# EasyEDA Pro project ProPrj_esp32s3-ai-chat_audio_2024-09-03.epro

# Schematic Schematic1
Board Name: Board1; Create Date: 2024-08-29
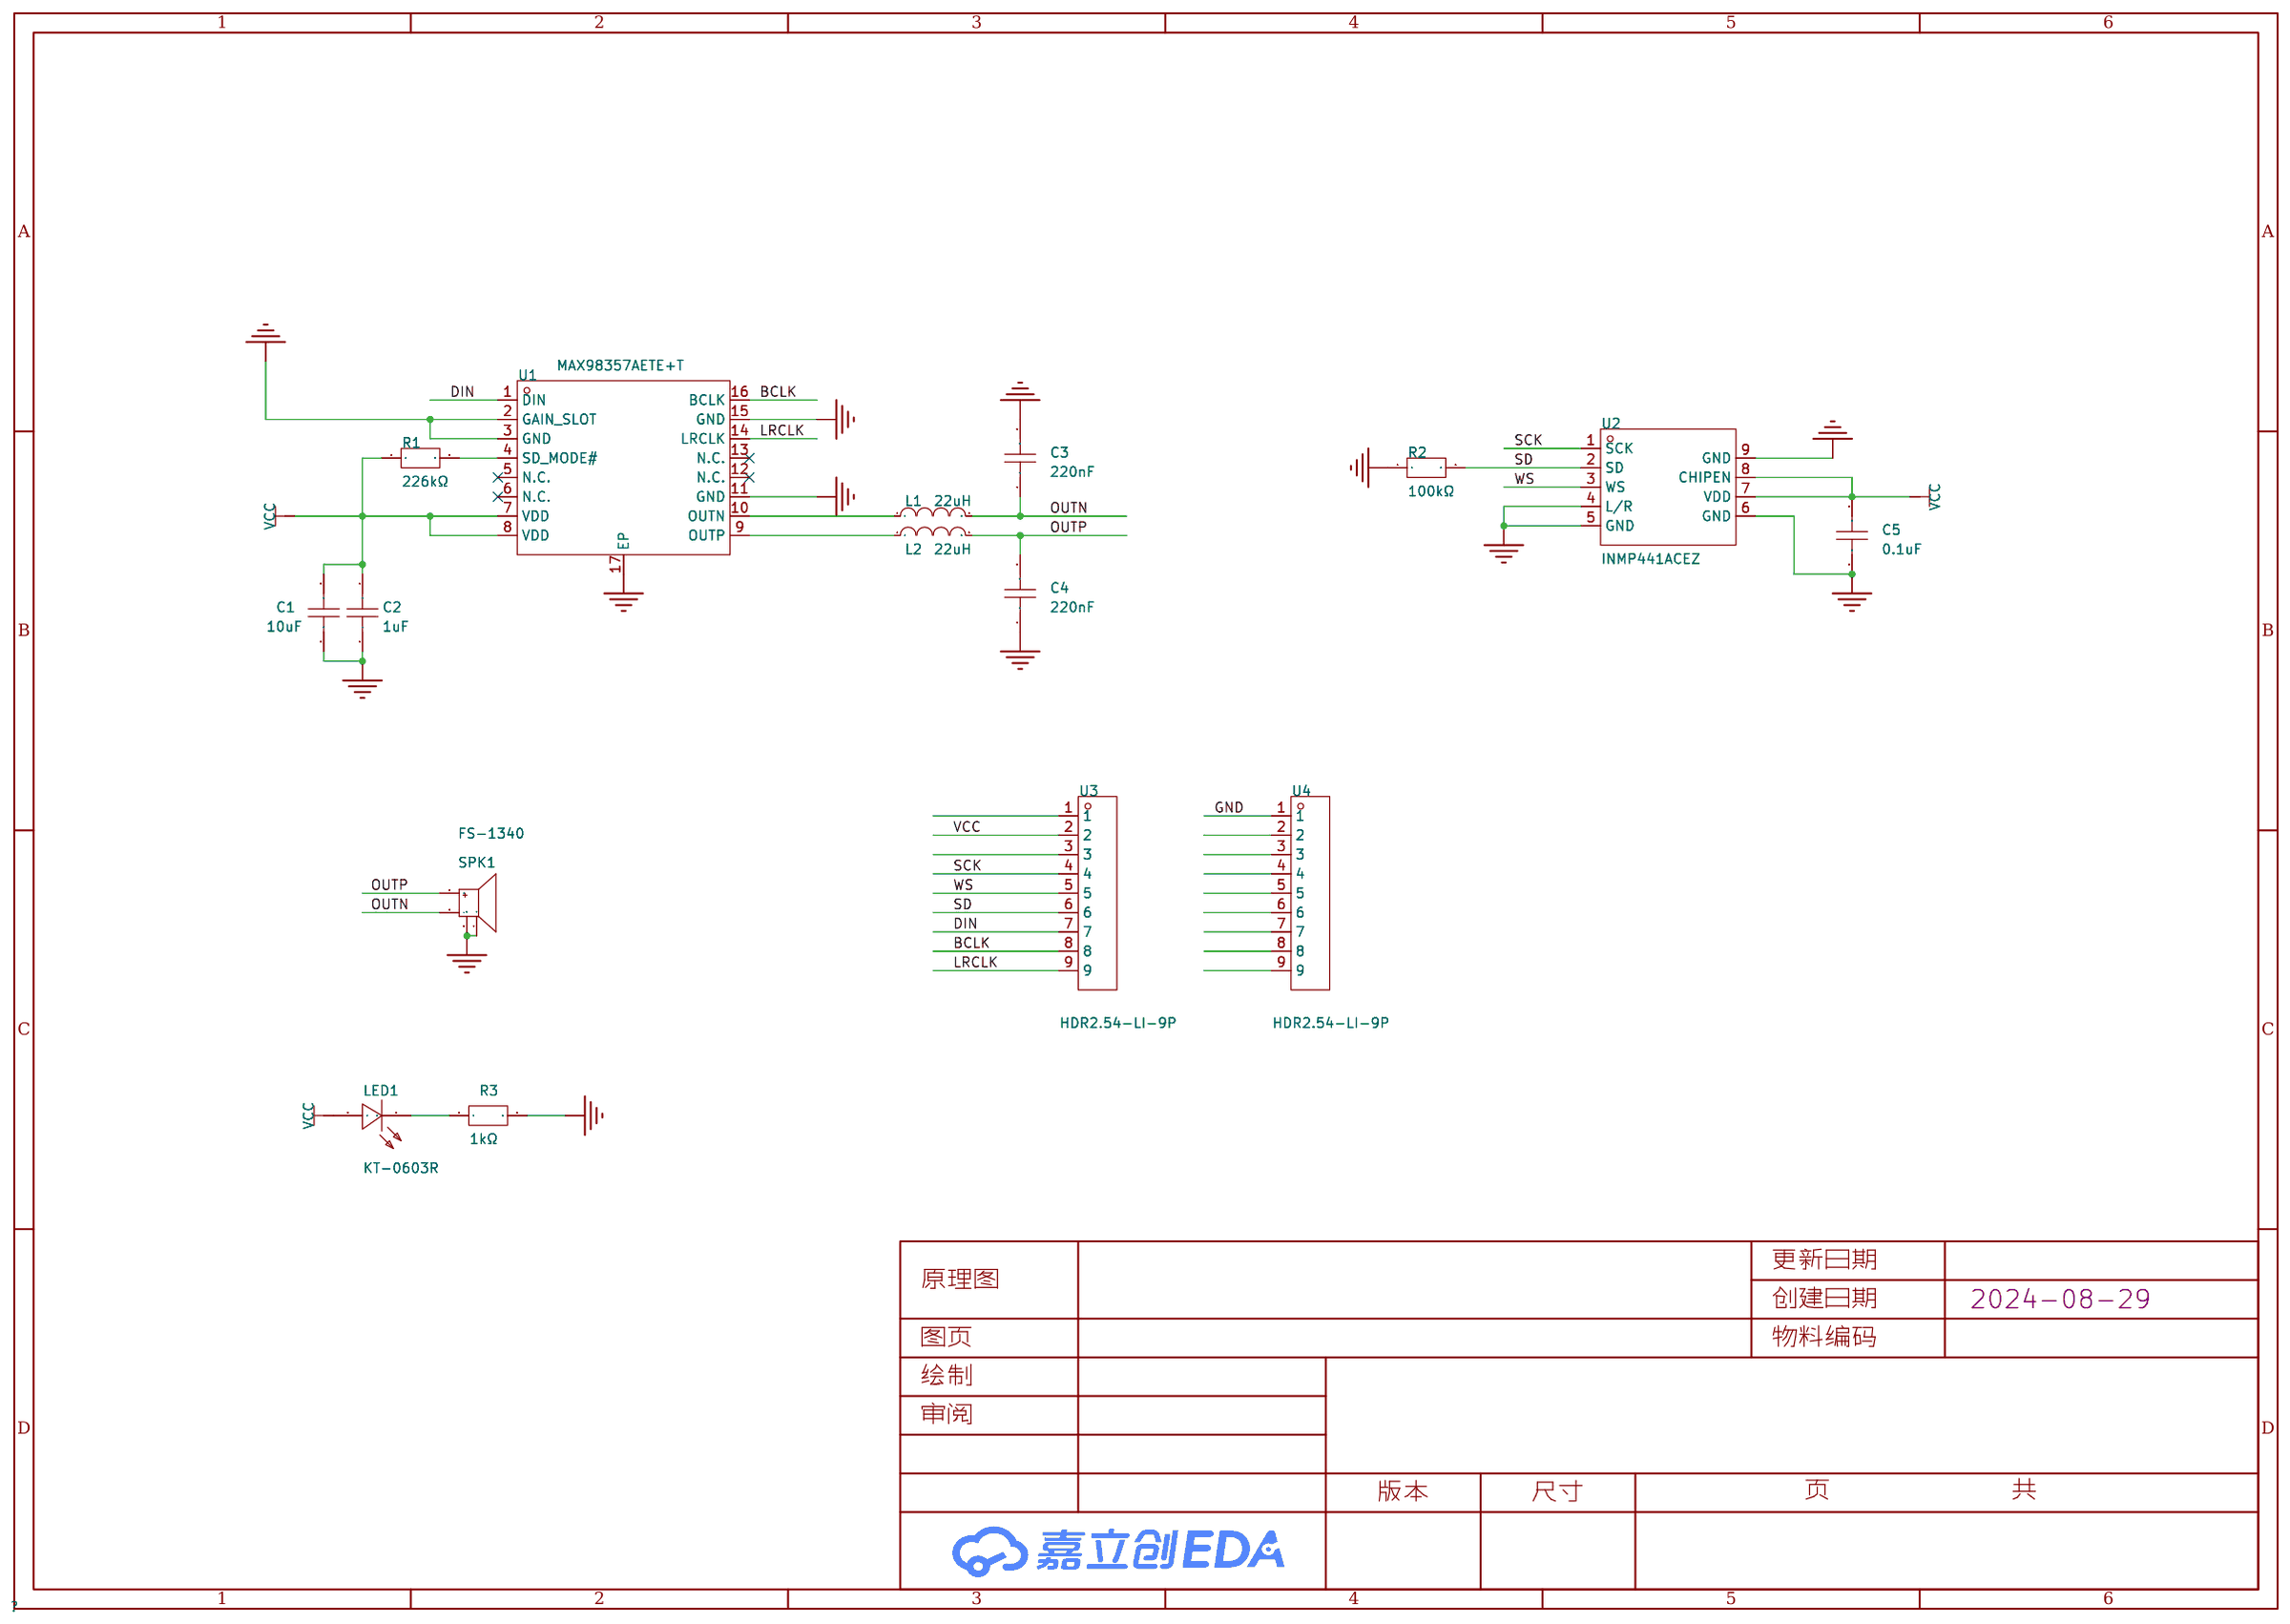
[diagram p0: schematic sheet]

## Parts
C1  10uF  [C0603]
C2  1uF  [C0603]
C3  220nF  [C0603]
C4  220nF  [C0603]
C5  0.1uF  [C0603]
L1  22uH  [L0603]
L2  22uH  [L0603]
LED1  KT-0603R  [LED0603-RD]
R1  226kΩ  [R0603]
R2  100kΩ  [R0603]
R3  1kΩ  [R0603]
SPK1  FS-1340  [BUZ-SMD_4P-L13.0-W13.0-P11.4-BL]
U1  MAX98357AETE+T  [TQFN-16_L3.0-W3.0-P0.50-BL-EP1.5]
U2  INMP441ACEZ  [MID-SMD_L4.7-W3.8_INMP441ACEZ]
U3  HDR2.54-LI-9P  [HDR-TH_9P-P2.54-V-M]
U4  HDR2.54-LI-9P  [HDR-TH_9P-P2.54-V-M]

## Library data of the parts
C1-C5 = GRT188C81A106ME13J: 容值:10uF;精度:±20%;额定电压:10V;材质(温度系数):X6S;; LCSC Part Name: 10uF ±20% 10V; Supplier Part: C3859070; Manufacturer: muRata(村田); Supplier Footprint: 0603; JLCPCB Part Class: 扩展库; Datasheet: https://atta.szlcsc.com/upload/public/pdf/source/20210818/CBE219D8DE527EBAD6F9BA52C7DC1A42.pdf; Supplier: LCSC; Tolerance: ±20%; Voltage Rated: 10V; Temperature Coefficient: X6S
L1 L2 = MLF1608C220M: 电感值:22uH;精度:±20%;额定电流:2mA;饱和电流(Isat):-;直流电阻(DCR):1.7Ω;; LCSC Part Name: 22uH ±20%; Supplier Part: C3910439; Manufacturer: TDK; Supplier Footprint: 0603; JLCPCB Part Class: 扩展库; Datasheet: https://atta.szlcsc.com/upload/public/pdf/source/20200601/C574026_39E6D4F4CCB543012DB5E9A7AB7C2E6F.pdf; Supplier: LCSC; Tolerance: ±20%; Rated Current: 2mA; DC Resistance (DCR): 1.7Ω; Q @ Freq: 20@1MHz; Frequency - Self Resonant: 18MHz
LED1 = KT-0603R: 发光颜色:红色;功率:-;正向电流:-;主波长:-;二极管配置:-;透镜颜色:-;色温:-;发光角度:-;载带方式:-;工作温度:-40℃~+85℃;; LCSC Part Name: 0603 红灯 高亮; Supplier Part: C2286; Manufacturer: KENTO; Supplier Footprint: 0603; JLCPCB Part Class: 基础库; Datasheet: https://atta.szlcsc.com/upload/public/pdf/source/20160616/1466072038404.pdf; Supplier: LCSC; Emitted Color: 红色; Operating Temperature: -40℃~+85℃
R1-R3 = HQ03W5J0104T5E: 电阻类型:-;阻值:100kΩ;精度:±5%;功率:200mW;最大工作电压:75V;温度系数:±100ppm/℃;; LCSC Part Name: 100kΩ ±5% 200mW; Supplier Part: C2792071; Manufacturer: UNI-ROYAL(厚声); Supplier Footprint: 0603; JLCPCB Part Class: 扩展库; Datasheet: https://atta.szlcsc.com/upload/public/pdf/source/20210330/C2758625_90D19EEA9B8C23AA9BAF71D52BD1DB3E.pdf; Supplier: LCSC; Tolerance: ±5%; Power(Watts): 200mW; Overload Voltage (Max): 75V; Temperature Coefficient: ±100ppm/℃; Operating Temperature Range: -55℃~+155℃
SPK1 = FS-1340: LCSC Part Name: 喇叭13*13MM-4.0H 8Ω0.5W 贴片; Supplier Part: C482342; Manufacturer: FUET(福声科技); JLCPCB Part Class: 扩展库; Datasheet: https://atta.szlcsc.com/upload/public/pdf/source/20200113/C482342_9BDDCA56EED20E8AF6A7D6A5F1ED1CC9.pdf; Supplier: LCSC
U1 = MAX98357AETE+T: 功放类型:-;扬声器通道数:单声道;输出功率:3.2Wx2@4Ω;; Supplier Part: C910544; Manufacturer: ADI(亚德诺)/MAXIM(美信); Supplier Footprint: TQFN-16-EP(3x3); JLCPCB Part Class: 扩展库; Datasheet: https://atta.szlcsc.com/upload/public/pdf/source/20210106/C910544_CB6DE4B2CEE254A72E6BDB40E718D281.pdf; Supplier: LCSC; Speaker Channels: 单声道; Output Power: 3.2Wx2@4Ω; Supply Voltage: 2.5V~5.5V; Operating Temperature: -40℃~+85℃
U2 = INMP441ACEZ: Supplier Part: C9900011556; Supplier Footprint: LGA-9; JLCPCB Part Class: 扩展库; Supplier: LCSC
U3 U4 = HDR2.54-LI-9P: Supplier Part: C9900020142; JLCPCB Part Class: 扩展库; Supplier: LCSC

## Nets
GND: C1.1 C2.1 C3.2 C4.1 C5.1 R2.1 R3.2 SPK1.3 SPK1.4 U1.2(GAIN_SLOT) U1.3(GND) U1.11(GND) U1.15(GND) U1.17(EP) U2.4(L/R) U2.5(GND) U2.6(GND) U2.9(GND) U4.1
VCC: C1.2 C2.2 C5.2 LED1.2(A) R1.1 U1.7(VDD) U1.8(VDD) U2.7(VDD) U2.8(CHIPEN) U3.2
BCLK: U1.16(BCLK) U3.8
DIN: U1.1(DIN) U3.7
LRCLK: U1.14(LRCLK) U3.9
OUTN: C3.1 L1.2 SPK1.2(-)
OUTP: C4.2 L2.2 SPK1.1(+)
SCK: U2.1(SCK) U3.4
SD: R2.2 U2.2(SD) U3.6
WS: U2.3(WS) U3.5
$1N644: L1.1 U1.10(OUTN)
$1N646: L2.1 U1.9(OUTP)
$1N654: R1.2 U1.4(SD_MODE#)
$1N3730: LED1.1(K) R3.1

Not connected (* = marked no-connect by the designer): U1 5(N.C.)* 6(N.C.)* 12(N.C.)* 13(N.C.)*; U3 1 3; U4 2 3 4 5 6 7 8 9

# Board PCB1
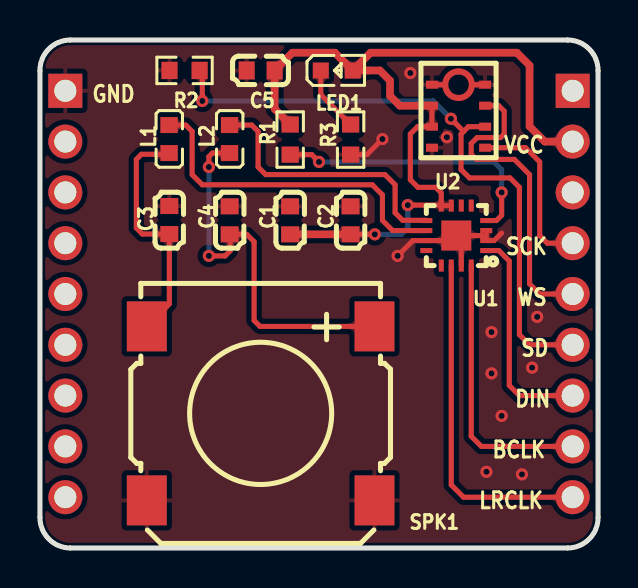
[diagram p1: board, top side]
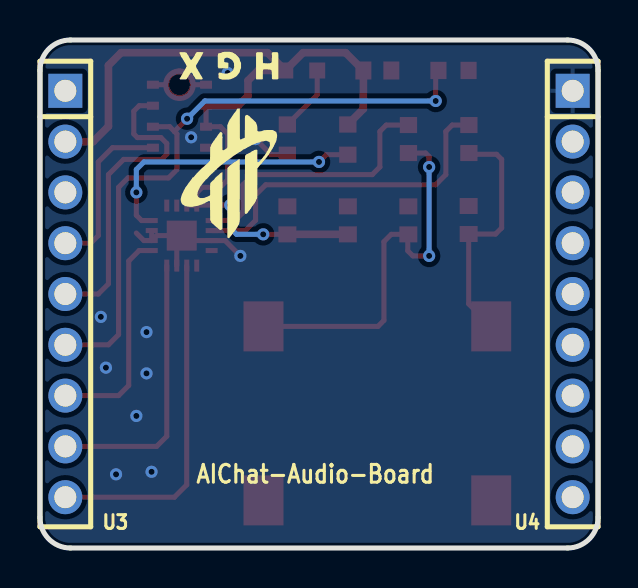
[diagram p2: board, bottom side, seen from below]

Outline 27.94 x 25.4 mm; copper layers: Top Layer, Bottom Layer. Coordinates in mm from the lower left corner of the outline.
Outline path: 0,23.88 0,1.52 arc(0.45,0.45) 1.52,0 26.42,0 arc(27.49,0.45) 27.94,1.52 27.94,23.88 arc(27.49,24.95) 26.42,25.4 1.52,25.4 arc(0.45,24.95) 0,23.88
Stack: Top Layer 0.035mm / Dielectric1 1.51mm FR4 er 4.5 / Bottom Layer 0.035mm

## Design rules (mm)
template: JLCPCB Capability(Two Layers Board)
spacing copperThickness1oz (default): track to track 0.102, other pairs 0.152 to 0.3
spacing copperThickness2oz: track to track 0.203, other pairs 0.152 to 0.3
track width copperThickness1oz (default): min 0.127, default 0.254, max 2.54
track width copperThickness2oz: min 0.203, default 0.254, max 2.54
differential pair differentialPair (default): width min 0.127, default 0.254, max 2.54; gap min 0.152, default 0.152
via viaSize (default): diameter min 0.5, default 0.61, max 10; hole min 0.3, default 0.305, max 6.3

## Placement (name value [footprint] x y rotation side)
C1  10uF  [C0603]  12.52 16.38 270 top
C2  1uF  [C0603]  15.55 16.38 270 top
C3  220nF  [C0603]  6.48 16.4 90 top
C4  220nF  [C0603]  9.5 16.38 270 top
C5  0.1uF  [C0603]  11.05 23.88 0 top
L1  22uH  [L0603]  6.47 20.45 270 top
L2  22uH  [L0603]  9.49 20.45 270 top
LED1  KT-0603R  [LED0603-RD]  14.86 23.87 0 top
R1  226kΩ  [R0603]  12.53 20.42 270 top
R2  100kΩ  [R0603]  7.24 23.88 0 top
R3  1kΩ  [R0603]  15.55 20.42 270 top
SPK1  FS-1340  [BUZ-SMD_4P-L13.0-W13.0-P11.4-BL]  11.05 6.73 180 top
U1  MAX98357AETE+T  [TQFN-16_L3.0-W3.0-P0.50-BL-EP1.5]  20.84 15.62 90 top
U2  INMP441ACEZ  [MID-SMD_L4.7-W3.8_INMP441ACEZ]  20.96 21.59 90 top
U3  HDR2.54-LI-9P  [HDR-TH_9P-P2.54-V-M]  26.67 12.7 270 bottom
U4  HDR2.54-LI-9P  [HDR-TH_9P-P2.54-V-M]  1.27 12.7 270 bottom

## Footprints (pads in the part's own frame, mm; a bottom-side part is the same pattern mirrored in y, then rotated)
BUZ-SMD_4P-L13.0-W13.0-P11.4-BL
  rect 2x2.5 smd: 1(-5.7,-4.35) 2(5.7,-4.35) 3(5.7,4.35) 4(-5.7,4.35)
C0603
  rect 0.8x0.9 smd: 1(-0.7,0) 2(0.7,0)
HDR-TH_9P-P2.54-V-M
  rect 1.7x1.7 hole 1.1: 1(-10.16,0)
  round 1.7 hole 1.1: 2(-7.62,0) 3(-5.08,0) 4(-2.54,0) 5(0,0) 6(2.54,0) 7(5.08,0) 8(7.62,0) 9(10.16,0)
L0603
  rect 0.8x0.864 smd: 1(-0.7,0) 2(0.7,0)
LED0603-RD
  rect 0.8x0.8 smd: 1(-0.799,0) 2(0.799,0)
MID-SMD_L4.7-W3.8_INMP441ACEZ
  rect 0.4x0.6 smd: 1(-1.575,-1.33) 2(-0.525,-1.33) 3(0.525,-1.33) 4(1.575,-1.33) 6(1.575,1.33) 7(0.525,1.33) 8(-0.525,1.33) 9(-1.575,1.33)
  custom 1.626x0.963 smd: 5(1.575,0.664)
  custom 1.626x0.966 smd: 5(1.575,-0.661)
R0603
  rect 0.806x0.864 smd: 1(-0.753,0) 2(0.753,0)
TQFN-16_L3.0-W3.0-P0.50-BL-EP1.5
  rect 0.25x0.6 smd: 1(-0.749,-1.5) 2(-0.248,-1.5) 3(0.252,-1.5) 4(0.751,-1.5) 9(0.75,1.5) 10(0.25,1.5) 11(-0.25,1.5) 12(-0.749,1.5)
  rect 0.6x0.25 smd: 5(1.5,-0.748) 6(1.5,-0.248) 7(1.5,0.252) 8(1.5,0.752) 13(-1.5,0.752) 14(-1.5,0.252) 15(-1.5,-0.248) 16(-1.5,-0.748)
  rect 1.5x1.5 smd: 17(0,0)

## Nets
As in the schematic.

Pads without a net: U1 5 6 12 13

## Via types
v1: diameter 0.61, hole 0.305, Top Layer to Bottom Layer, 19 vias

## Routing (per net, layer and track width the routed paths; a pad name or vN(x,y) marks a point on that pad's centre or on a via; arc(x,y) is an arc through that point)
GND: length 11.2
  Top Layer w0.254: v1(17.91,14.61) 18.67,15.37 U1.11 20.59,15.37 U1.17 ; 21.09,14.12 21.09,15.37 U1.17 ; U1.17 22.09,15.62 U1.2 ; v1(17.15,20.45) 16.37,19.67 R3.2 ; U1.2 22.74,15.37 23.11,15.75 ; U1.2 U1.3 ; U2.6 U2.5 ; 22.28,23.17 U2.5
  vias: v1(18.54,23.75) v1(20.37,20.54) v1(22.35,3.81) v1(22.61,10.8) v1(22.61,8.73) v1(23.11,6.6) v1(24.13,3.68) v1(24.64,9.02) v1(24.89,11.56)
VCC: length 44.2
  Top Layer w0.254: 20.09,17.12 20.59,17.12 ; 20.09,17.12 20.09,17.76 19.81,18.03 18.92,18.03 18.54,18.42 18.54,20.7 18.91,21.07 U2.8 U2.7 ; 20.09,17.12 20.07,17.15 v1(18.41,17.15) ; C2.2 v1(16.76,15.68)
  Top Layer w0.381: 15.66,23.88 16.55,24.77 23.88,24.77 24.51,24.13 24.51,21.08 25.27,20.32 U3.2 ; 15.66,23.88 LED1.2 14.77,24.77 12.64,24.77 C5.2 11.75,21.95 R1.1 ; 15.66,23.88 17.02,23.88 17.53,23.37 17.53,22.61 18.02,22.12 U2.7 ; C1.2 C2.2
  Bottom Layer w0.254: v1(16.76,15.68) 18.1,15.68 18.41,16 v1(18.41,17.15)
BCLK: length 13.8
  Top Layer w0.254: 21.59,14.12 21.59,5.59 22.1,5.08 U3.8
DIN: length 11
  Top Layer w0.254: U1.1 22.97,14.87 23.5,14.35 23.5,8.13 24,7.62 U3.7
LRCLK: length 17.3
  Top Layer w0.254: U3.9 21.21,2.54 20.59,3.16 20.59,14.12
OUTN: length 12.1
  Top Layer w0.254: L1.2 6.4,19.69 5.08,19.69 4.83,19.43 4.83,16 5.13,15.7 C3.1 6.48,12.21 5.35,11.08
OUTP: length 19.5
  Top Layer w0.254: L2.2 8.64,19.75 8.46,19.57 v1(8.46,19.05) ; v1(8.46,14.61) 9.27,14.61 9.53,14.86 9.53,15.66 C4.2 10.35,15.68 10.72,15.31 10.72,11.38 11.02,11.08 SPK1.1
  Bottom Layer w0.254: v1(8.46,19.05) v1(8.46,14.61)
SCK: length 8.5
  Top Layer w0.254: 22.28,20.02 24.31,20.02 25.02,19.3 25.02,15.62 25.4,15.24 U3.4
SD: length 32
  Top Layer w0.254: 22.28,21.07 21.45,21.07 21.21,20.83 ; v1(20.57,21.46) 21.21,20.83 ; 21.21,20.83 21.08,20.7 21.08,18.92 21.5,18.5 23.53,18.5 24,18.03 24,10.67 24.51,10.16 U3.6 ; v1(8.13,22.35) 8.13,23.74 R2.2
  Bottom Layer w0.254: v1(8.13,22.35) 19.69,22.35 v1(20.57,21.46)
WS: length 15.8
  Top Layer w0.254: U3.5 25.02,12.7 24.51,13.21 24.51,18.67 23.75,19.43 21.84,19.43 21.59,19.69 21.59,20.23 21.89,20.52 23.06,20.52 23.24,20.7 23.24,21.84 22.97,22.12 22.28,22.12
$1N644: length 17.1
  Top Layer w0.254: U1.10 17.66,15.87 17.15,16.38 17.15,17.65 16.64,18.16 8.13,18.16 7.62,18.67 7.62,20.83 7.3,21.15 L1.1
$1N646: length 13.7
  Top Layer w0.254: U1.9 19.33,16.38 18.16,16.38 17.78,16.76 17.78,18.16 17.27,18.67 11.3,18.67 10.92,19.05 10.92,20.83 10.6,21.15 L2.1
$1N654: length 14.1
  Top Layer w0.254: U1.4 22.85,16.37 23.11,16.64 v1(23.11,17.78) ; v1(13.97,19.3) 13.61,19.67 R1.2
  Bottom Layer w0.254: v1(13.97,19.3) 22.73,19.3 23.11,18.92 v1(23.11,17.78)
$1N3730: length 3.3
  Top Layer w0.254: 14.06,23.87 14.06,22.67 R3.1

## Copper pours and planes (outline as drawn; the poured copper is in the pictures)
GND on Top Layer: -2.16,26.67 31.37,26.67 31.37,-1.4 -2.16,-1.4
GND on Bottom Layer: -2.29,26.92 31.12,26.92 31.12,-1.52 -2.29,-1.52

Small or netless copper shapes (teardrops, artwork), in the pictures only: 59 on Top Layer, 8 on Bottom Layer

## Text on the board
Bottom Silkscreen Layer: AIChat-Audio-Board
Top Silkscreen Layer: GND | LRCLK | BCLK | VCC | SCK | DIN | WS | SD
